# EAGLE design first proper board (EAGLE 9.6.2)
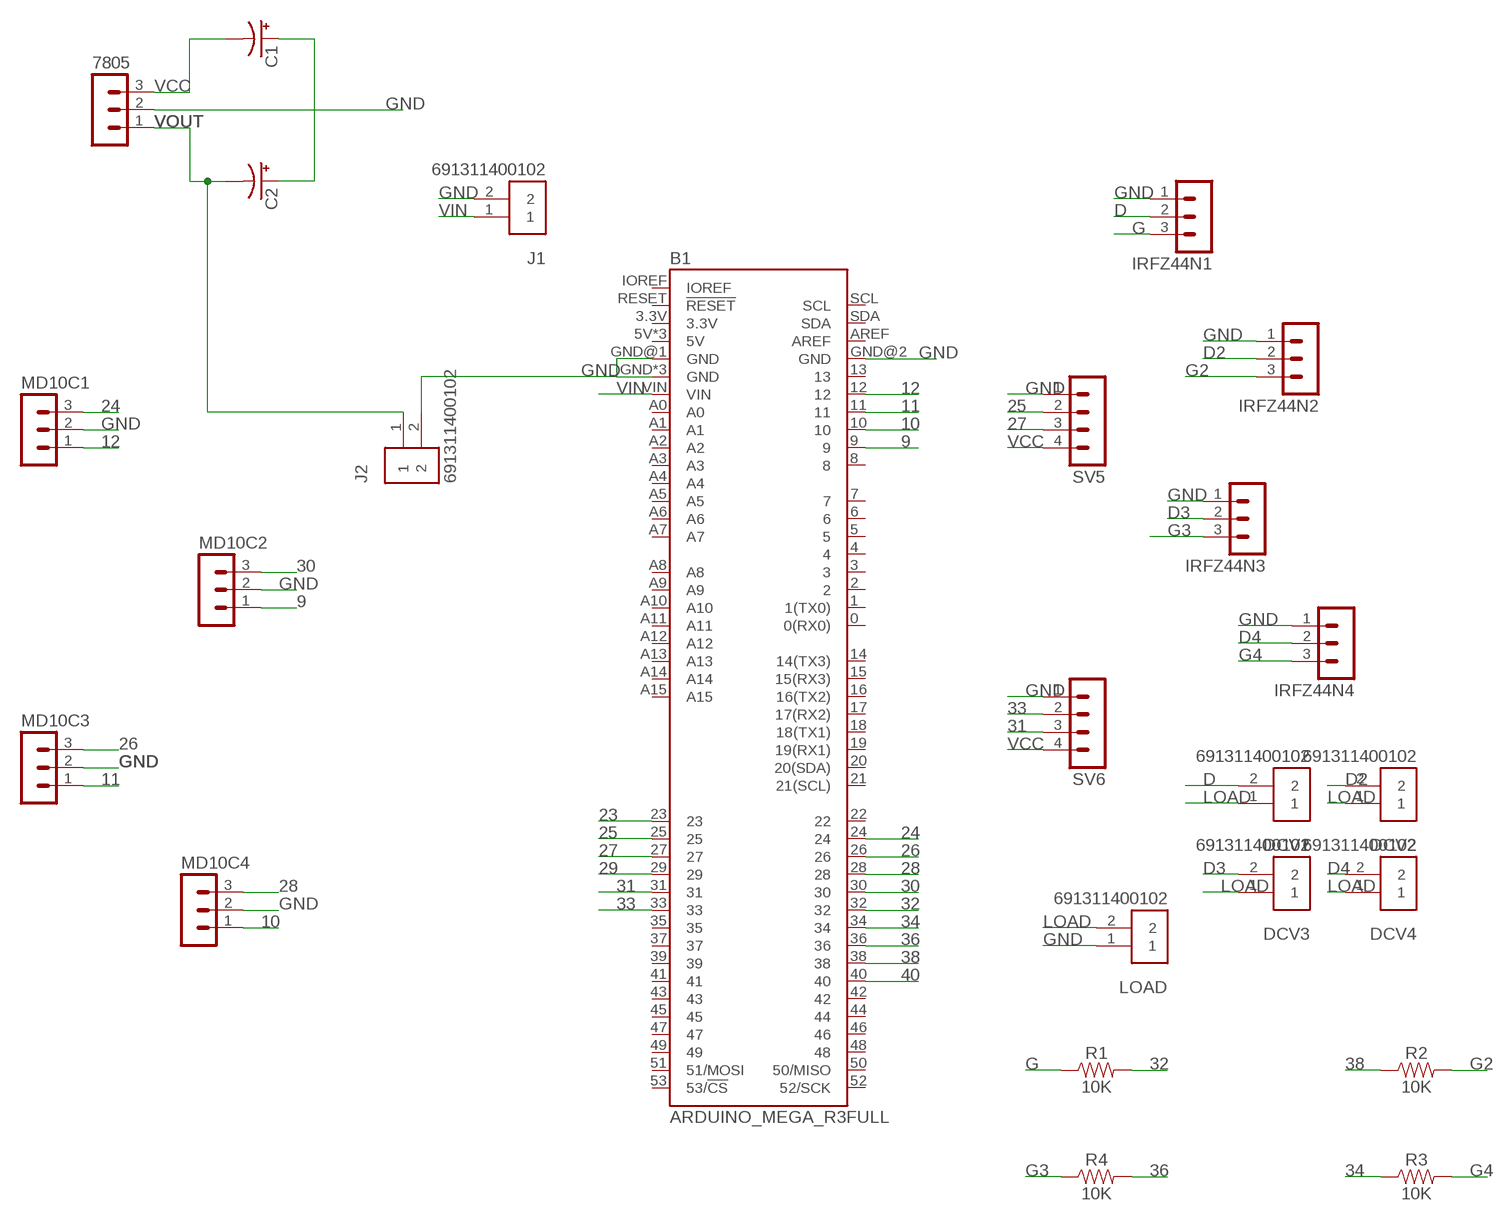
[diagram p0: schematic, sheet 1]

## Parts
7805  MA03-1  [MA03-1]
B1  ARDUINO_MEGA_R3FULL  [ARDUINO_MEGA_NO_SILK]
C1  1F-2.7V(PTH)CPOL-RADIAL-1H-2.7V  [CPOL-RADIAL-1F-2.7V]
C2  1F-2.7V(PTH)CPOL-RADIAL-1H-2.7V  [CPOL-RADIAL-1F-2.7V]
DCV1  691311400102  [TERMINALBLOCK_PLUGGABLE-2-7.62MM]
DCV2  691311400102  [TERMINALBLOCK_PLUGGABLE-2-7.62MM]
DCV3  691311400102  [TERMINALBLOCK_PLUGGABLE-2-7.62MM]
DCV4  691311400102  [TERMINALBLOCK_PLUGGABLE-2-7.62MM]
IRFZ44N1  MA03-1  [MA03-1]
IRFZ44N2  MA03-1  [MA03-1]
IRFZ44N3  MA03-1  [MA03-1]
IRFZ44N4  MA03-1  [MA03-1]
J1  691311400102  [TERMINALBLOCK_PLUGGABLE-2-7.62MM]
J2  691311400102  [TERMINALBLOCK_PLUGGABLE-2-7.62MM]
LOAD  691311400102  [TERMINALBLOCK_PLUGGABLE-2-7.62MM]
MD10C1  MA03-1  [MA03-1]
MD10C2  MA03-1  [MA03-1]
MD10C3  MA03-1  [MA03-1]
MD10C4  MA03-1  [MA03-1]
R1  10K  10KOHM-0402-1/10W-0.1%  [0402-TIGHT]
R2  10K  10KOHM-0402-1/10W-0.1%  [0402-TIGHT]
R3  10K  10KOHM-0402-1/10W-0.1%  [0402-TIGHT]
R4  10K  10KOHM-0402-1/10W-0.1%  [0402-TIGHT]
SV5  MA04-1  [MA04-1]
SV6  MA04-1  [MA04-1]

## Nets
9: B1.9 MD10C2.1
10: B1.10 MD10C4.1
11: B1.11 MD10C3.1
12: B1.12 MD10C1.1
23: B1.23
24: B1.24 MD10C1.3
25: B1.25 SV5.2
26: B1.26 MD10C3.3
27: B1.27 SV5.3
28: B1.28 MD10C4.3
29: B1.29
30: B1.30 MD10C2.3
31: B1.31 SV6.3
32: B1.32 R1.2
33: B1.33 SV6.2
34: B1.34 R3.1
36: B1.36 R4.2
38: B1.38 R2.1
40: B1.40
D: DCV1.2 IRFZ44N1.2
D2: DCV2.2 IRFZ44N2.2
D3: DCV3.2 IRFZ44N3.2
D4: DCV4.2 IRFZ44N4.2
G: IRFZ44N1.3 R1.1
G2: IRFZ44N2.3 R2.2
G3: IRFZ44N3.3 R4.1
G4: IRFZ44N4.3 R3.2
GND: 7805.2 B1.GND B1.GND@1(GND) B1.GND@2(GND) B1.GND@3(GND) B1.GND@4(GND) IRFZ44N1.1 IRFZ44N2.1 IRFZ44N3.1 IRFZ44N4.1 J1.2 J2.2 LOAD.1 MD10C1.2 MD10C2.2 MD10C3.2 MD10C4.2 SV5.1 SV6.1
LOAD: DCV1.1 DCV2.1 DCV3.1 DCV4.1 LOAD.2
N$1: C1.+ C2.+
VCC: 7805.3 C1.- SV5.4 SV6.4
VIN: B1.VIN J1.1
VOUT: 7805.1 C2.- J2.1
Unconnected: B1.0(0(RX0)) B1.1(1(TX0)) B1.2 B1.3 B1.3.3V B1.4 B1.5 B1.5V B1.5V@1(5V) B1.5V@2(5V) B1.6 B1.7 B1.8 B1.13 B1.14(14(TX3)) B1.15(15(RX3)) B1.16(16(TX2)) B1.17(17(RX2)) B1.18(18(TX1)) B1.19(19(RX1)) B1.20(20(SDA)) B1.21(21(SCL)) B1.22 B1.35 B1.37 B1.39 B1.41 B1.42 B1.43 B1.44 B1.45 B1.46 B1.47 B1.48 B1.49 B1.50(50/MISO) B1.51(51/MOSI) B1.52(52/SCK) B1.53(53/!CS) B1.A0 B1.A1 B1.A2 B1.A3 B1.A4 B1.A5 B1.A6 B1.A7 B1.A8 B1.A9 B1.A10 B1.A11 B1.A12 B1.A13 B1.A14 B1.A15 B1.AREF B1.IOREF B1.RESET(!RESET) B1.SCL B1.SDA

## Library data of the parts
7805 IRFZ44N1-IRFZ44N4 MD10C1-MD10C4 = con-lstb:MA03-1: PIN HEADER; OC_FARNELL: unknown; OC_NEWARK: unknown
B1 = SparkFun-Boards:ARDUINO_MEGA_R3: Arduino Mega R3 ATmega2560 R3 compatible footprint. SparkFun Products: Arduino Mega 2560 R3 <https://www.sparkfun.com/products/11061>
C1 C2 = SparkFun-Capacitors:1F-2.7V(PTH): 1F 2.7V SuperCapacitor CAP-14696; PROD_ID: CAP-14696
DCV1-DCV4 J1 J2 LOAD = Terminal Blocks FOR USE IN PB:691311400102: 7.62MM CLOSE VERTICAL PCB HEADER WR-TBL Manufacturer's datasheet <https://katalog.we-online.com/em/datasheet/6913114001xx.pdf>; CREATED_BY: PCBLayout.com; DIGIKEY_PART_NO: 732-2823-ND; MANUFACTURER: WURTH ELEKTRONIK; MPN: 691311400102
R1-R4 = SparkFun-Resistors:10KOHM: 10kΩ resistor A resistor is a passive two-terminal electrical component that implements electrical resistance as a circuit element. Resistors act to reduce current flow, and, at the same time, act to lower voltage levels within circuits. - Wikipedia; PROD_ID: RES-16147
SV5 SV6 = con-lstb:MA04-1: PIN HEADER; OC_FARNELL: unknown; OC_NEWARK: unknown

## Board
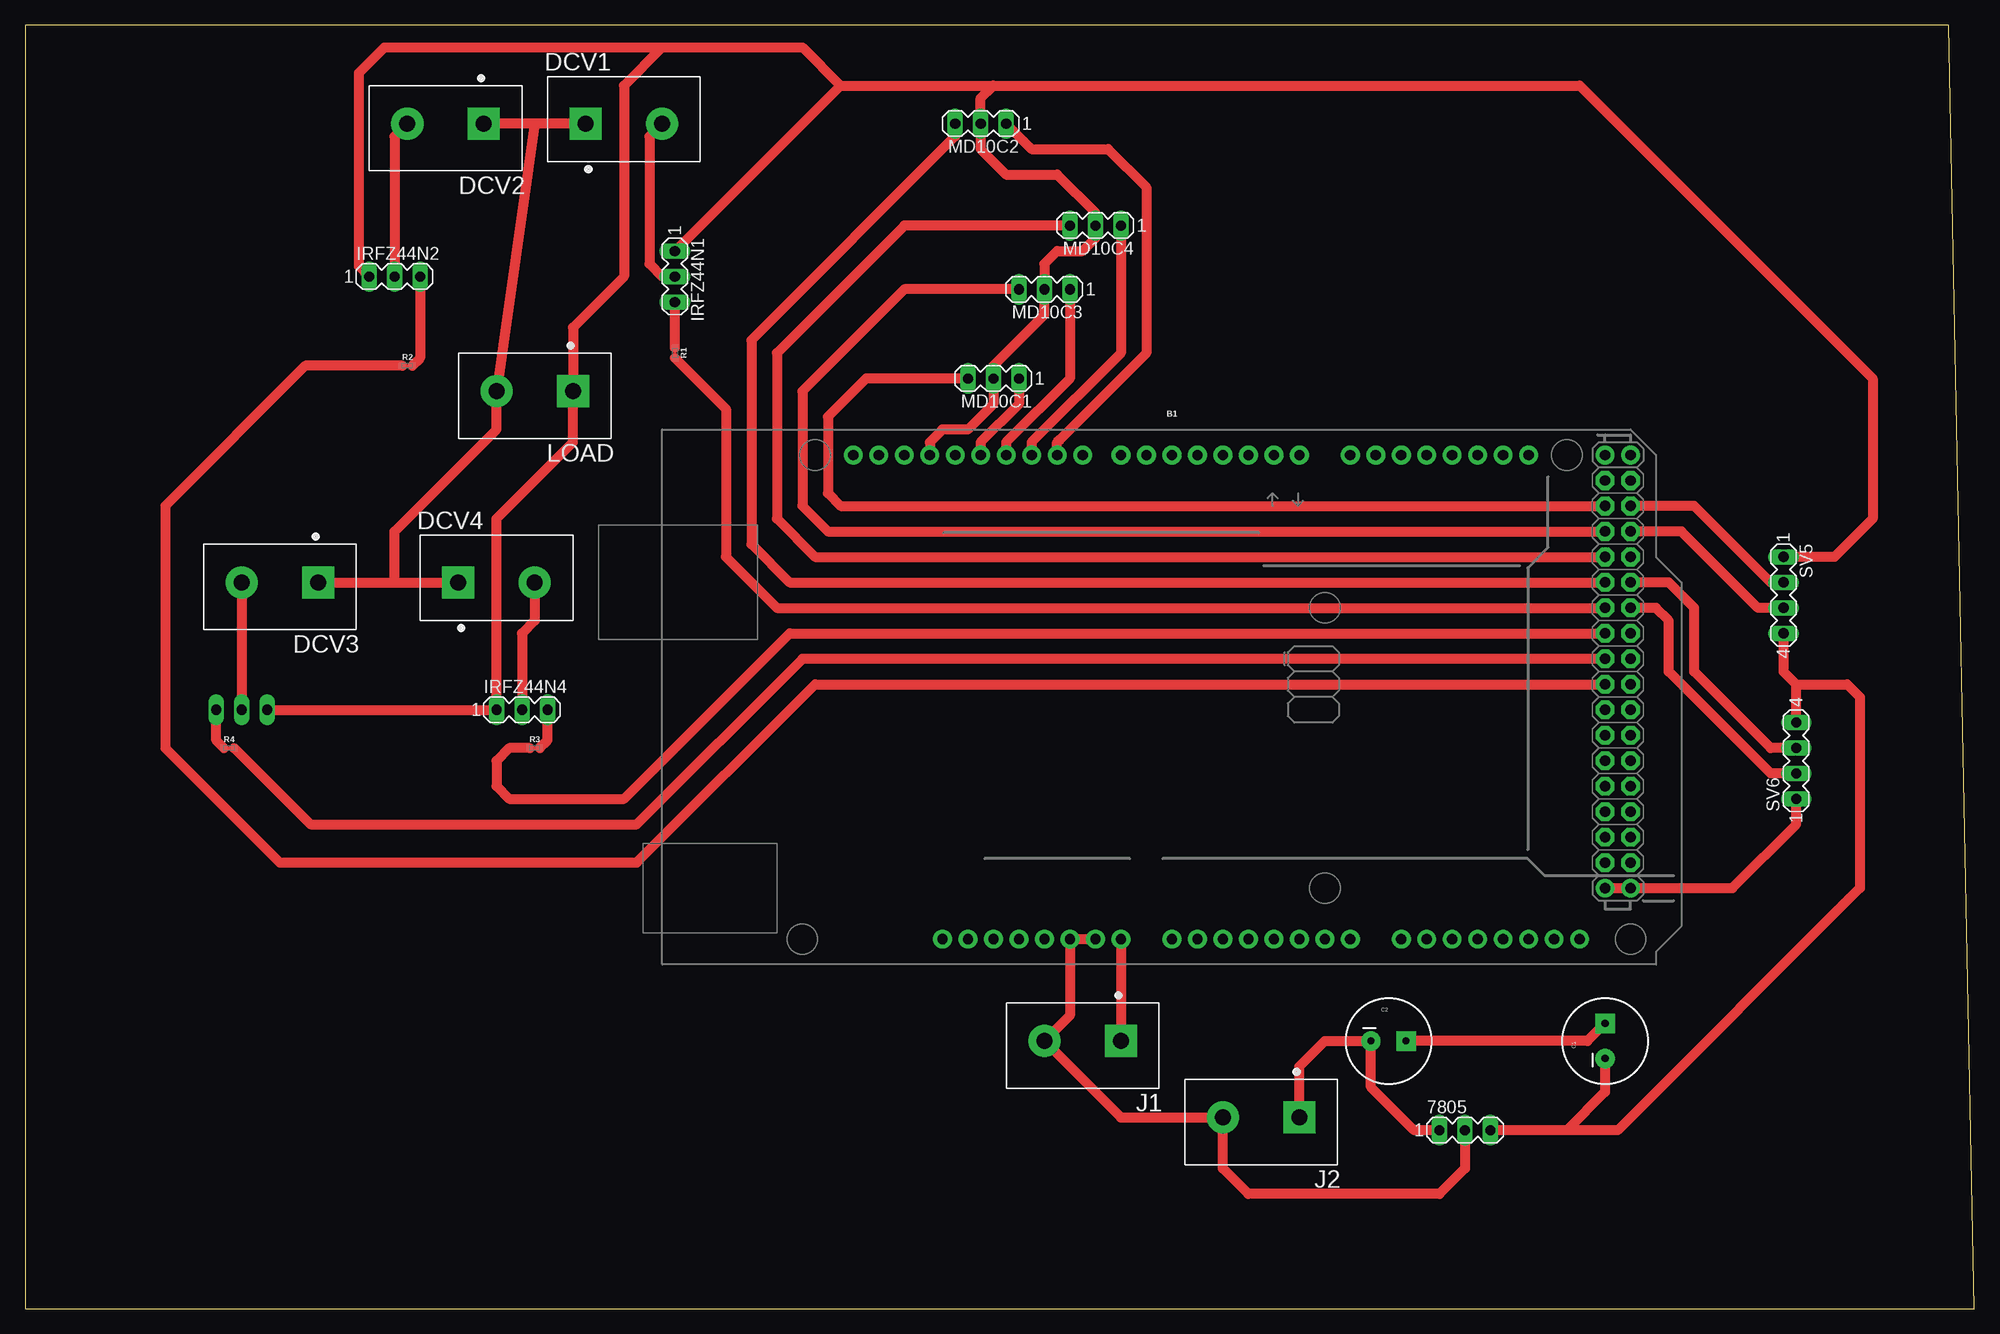
[diagram p1: board, top side]
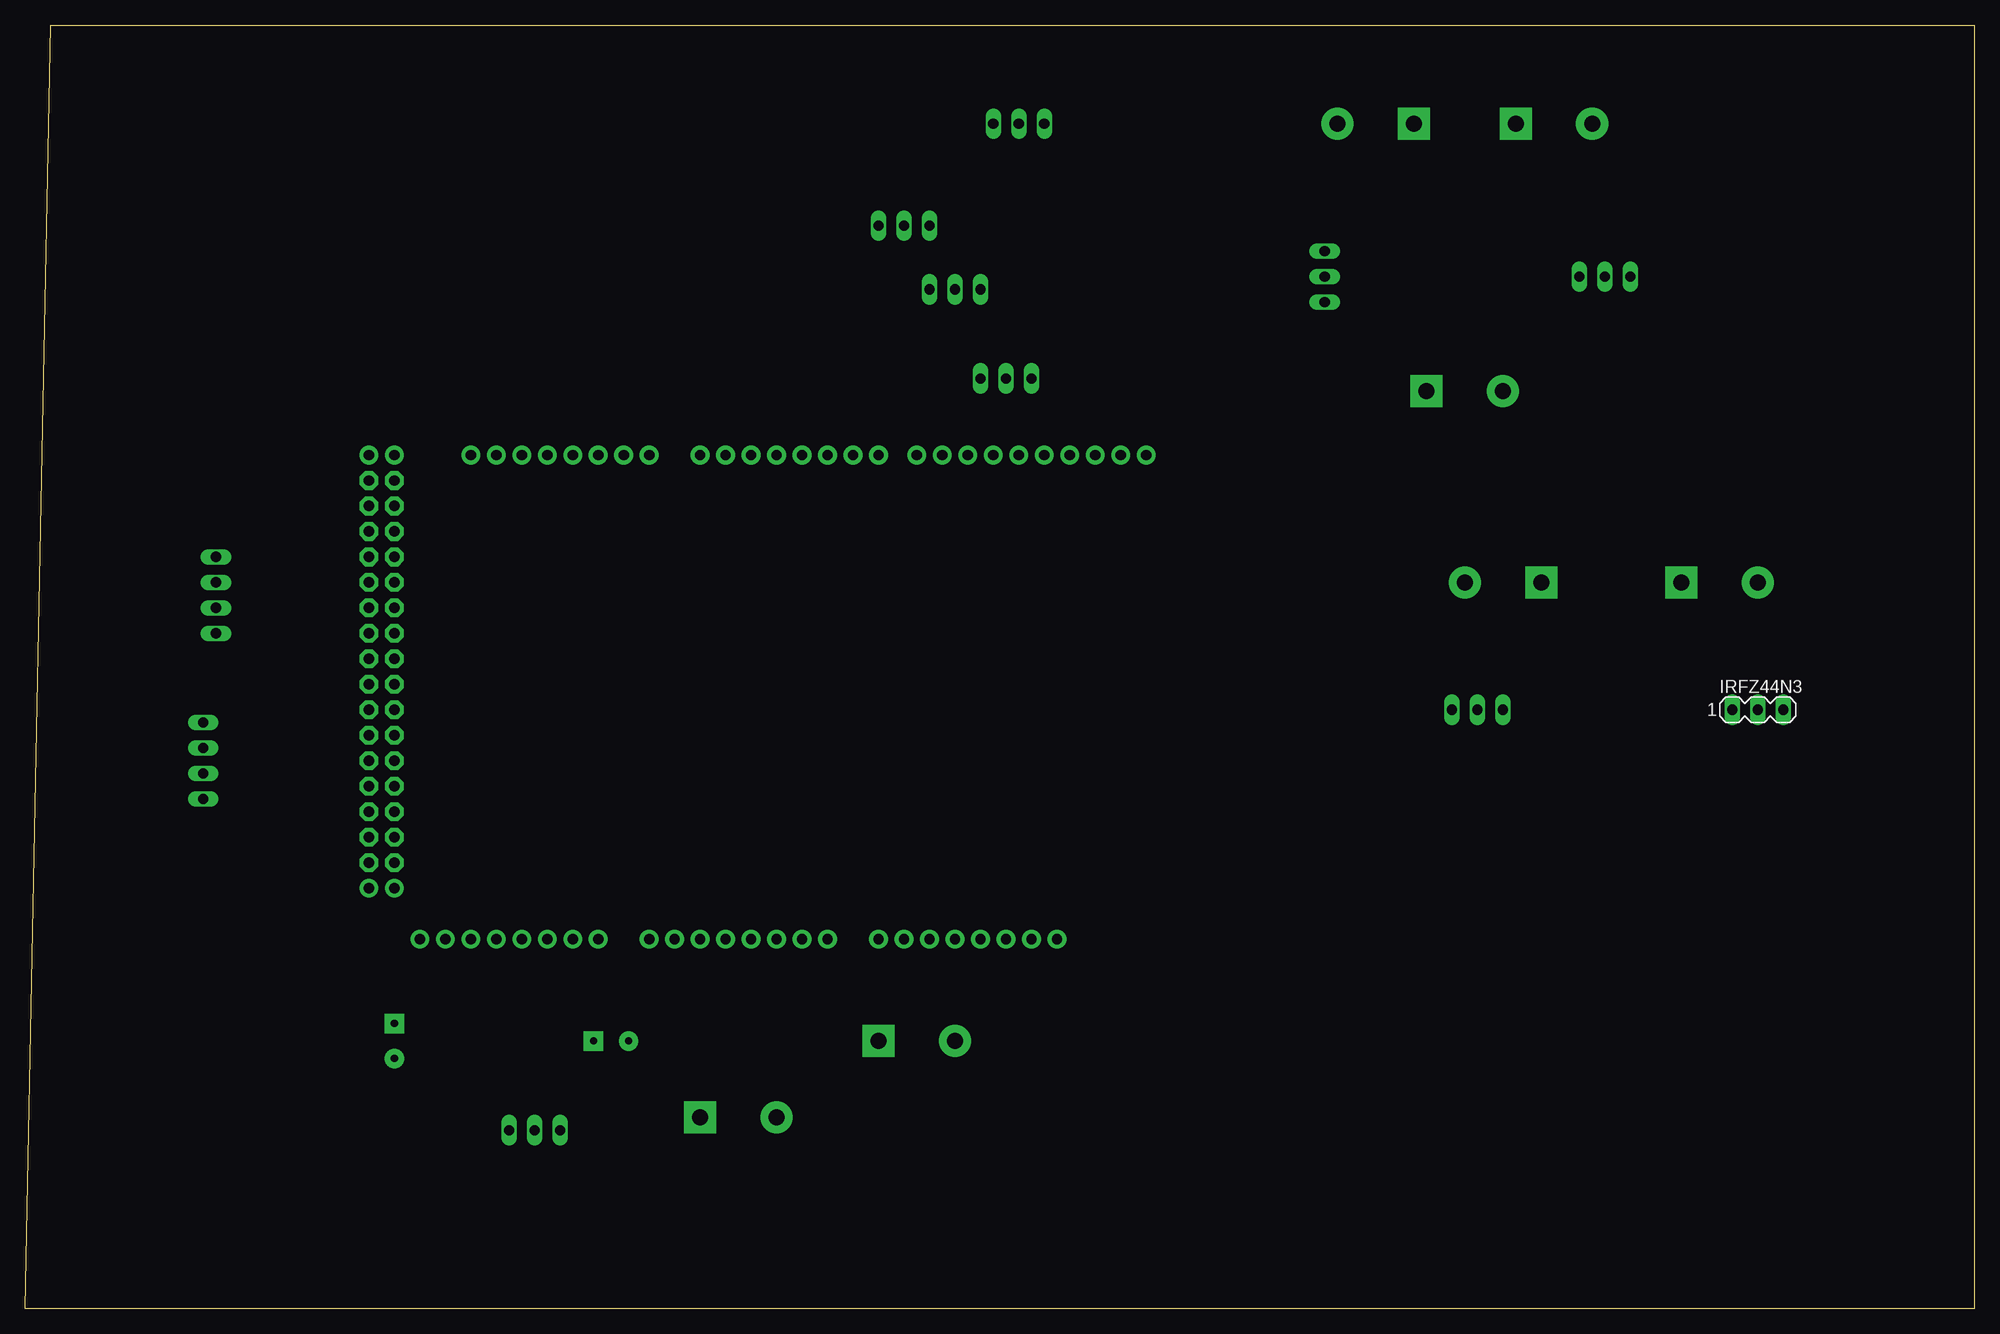
[diagram p2: board, bottom side, seen from below]

Size 194.29 x 127.94 mm. Coordinates in mm from the lower left corner, seen from the top.
Outline: 0,0 194.29,0 191.75,127.94 0,127.94 0,0
Copper layers (1*16): Top 0.035mm / dielectric 1.5mm / Bottom 0.035mm
Design rules "default": minimum track width 6mil, minimum drill 0.35mm, track to track 6mil, track to pad 6mil, pad to pad 6mil, via to via 6mil, smd to smd 6mil, copper to edge 40mil, drill to drill 6mil, minimum pad ring 10mil, minimum via ring 8mil, stop-mask expansion 4mil, vias tented up to drill 0mil, thermal gap 10mil

### Footprints (pad centres in the part's own frame; a part is rotated, then mirrored left to right if it is on the bottom)
MA03-1 = drill 1.016 long: 1 -2.54,0; 2 0,0; 3 2.54,0
ARDUINO_MEGA_NO_SILK = drill 1.016 pad 1.88: 0 13.97,24.13; 1 11.43,24.13; 2 8.89,24.13; 3 6.35,24.13; 3.3V -13.97,-24.13; 4 3.81,24.13; 5 1.27,24.13; 5V -11.43,-24.13; 5V@1 44.45,24.13; 5V@2 46.99,24.13; 6 -1.27,24.13; 7 -3.81,24.13; 8 -7.62,24.13; 9 -10.16,24.13; 10 -12.7,24.13; 11 -15.24,24.13; 12 -17.78,24.13; 13 -20.32,24.13; 14 19.05,24.13; 15 21.59,24.13; 16 24.13,24.13; 17 26.67,24.13; 18 29.21,24.13; 19 31.75,24.13; 20 34.29,24.13; 21 36.83,24.13; A0 1.27,-24.13; A1 3.81,-24.13; A2 6.35,-24.13; A3 8.89,-24.13; A4 11.43,-24.13; A5 13.97,-24.13; A6 16.51,-24.13; A7 19.05,-24.13; A8 24.13,-24.13; A9 26.67,-24.13; A10 29.21,-24.13; A11 31.75,-24.13; A12 34.29,-24.13; A13 36.83,-24.13; A14 39.37,-24.13; A15 41.91,-24.13; AREF -25.4,24.13; GND -8.89,-24.13; GND@1 -6.35,-24.13; GND@2 44.45,-19.05; GND@3 46.99,-19.05; GND@4 -22.86,24.13; IOREF -19.05,-24.13; NC -21.59,-24.13; RESET -16.51,-24.13; SCL -30.48,24.13; SDA -27.94,24.13; VIN -3.81,-24.13 | drill 1.016 pad 1.88 octagon: 22 44.45,21.59; 23 46.99,21.59; 24 44.45,19.05; 25 46.99,19.05; 26 44.45,16.51; 27 46.99,16.51; 28 44.45,13.97; 29 46.99,13.97; 30 44.45,11.43; 31 46.99,11.43; 32 44.45,8.89; 33 46.99,8.89; 34 44.45,6.35; 35 46.99,6.35; 36 44.45,3.81; 37 46.99,3.81; 38 44.45,1.27; 39 46.99,1.27; 40 44.45,-1.27; 41 46.99,-1.27; 42 44.45,-3.81; 43 46.99,-3.81; 44 44.45,-6.35; 45 46.99,-6.35; 46 44.45,-8.89; 47 46.99,-8.89; 48 44.45,-11.43; 49 46.99,-11.43; 50 44.45,-13.97; 51 46.99,-13.97; 52 44.45,-16.51; 53 46.99,-16.51
CPOL-RADIAL-1F-2.7V = drill 0.7 pad 1.93 square: + 1.75,0 | drill 0.7 pad 1.93: - -1.75,0
TERMINALBLOCK_PLUGGABLE-2-7.62MM = drill 1.6 pad 3.2 square: 1 -3.81,0 | drill 1.6 pad 3.2: 2 3.81,0
0402-TIGHT = smd 0.6 x 0.6: 1 -0.5,0; 2 0.5,0
MA04-1 = drill 1.016 long: 1 -3.81,0; 2 -1.27,0; 3 1.27,0; 4 3.81,0

### Placement (x,y rotation side)
7805  143.51,17.78 0 top
B1  113.03,60.96 0 top
C1  157.48,26.67 90 top
C2  135.89,26.67 0 top
DCV1  59.69,118.11 0 top
DCV2  41.91,118.11 180 top
DCV3  25.4,72.39 180 top
DCV4  46.99,72.39 0 top
IRFZ44N1  64.77,102.87 270 top
IRFZ44N2  36.83,102.87 0 top
IRFZ44N3  21.59,59.69 0 bottom
IRFZ44N4  49.53,59.69 0 top
J1  105.41,26.67 180 top
J2  123.19,19.05 180 top
LOAD  50.8,91.44 180 top
MD10C1  96.52,92.71 180 top
MD10C2  95.25,118.11 180 top
MD10C3  101.6,101.6 180 top
MD10C4  106.68,107.95 180 top
R1  64.77,95.25 270 top
R2  38.1,93.98 0 top
R3  50.8,55.88 0 top
R4  20.32,55.88 0 top
SV5  175.26,71.12 270 top
SV6  176.53,54.61 90 top

### Tracks (layer width: path | path; a pad name or v marks a point on that pad's centre or on a via)
9
  Top 1.016: MD10C2.1 100.33,115.57 107.95,115.57 111.76,111.76 111.76,95.25 103.2,86.69 102.87,86.36 B1.9
10
  Top 1.016: B1.10 100.33,86.36 109.22,95.25 MD10C4.1
11
  Top 1.016: MD10C3.1 104.14,92.71 97.79,86.36 B1.11
12
  Top 1.016: 99.06,91.44 MD10C1.1 99.06,90.17 95.25,86.36 B1.12
24
  Top 1.016: MD10C1.3 83.82,92.71 80.01,88.9 80.01,81.28 81.28,80.01 B1.24
25
  Top 1.016: SV5.2 173.99,72.39 166.37,80.01 162.56,80.01 161.62,80.01 B1.25
26
  Top 1.016: B1.26 80.01,77.47 77.47,80.01 77.47,91.44 87.63,101.6 MD10C3.3
27
  Top 1.016: SV5.3 172.72,69.85 165.1,77.47 162.56,77.47 161.62,77.47 B1.27
28
  Top 1.016: MD10C4.3 87.63,107.95 74.93,95.25 74.93,78.74 78.74,74.93 B1.28
30
  Top 1.016: MD10C2.3 92.71,116.84 72.39,96.52 72.39,76.2 76.2,72.39 B1.30
31
  Top 1.016: SV6.3 173.99,55.88 166.37,63.5 166.37,69.85 163.83,72.39 B1.31
32
  Top 1.016: R1.2 69.85,89.67 69.85,74.93 74.93,69.85 B1.32
33
  Top 1.016: SV6.2 173.99,53.34 163.83,63.5 163.83,68.58 162.56,69.85 161.62,69.85 B1.33
34
  Top 1.016: R3.1 48.26,55.88 46.99,54.61 46.99,52.07 48.26,50.8 59.69,50.8 76.2,67.31 B1.34
36
  Top 1.016: R4.2 28.44,48.26 60.96,48.26 77.47,64.77 B1.36
38
  Top 1.016: R2.1 27.94,93.98 13.97,80.01 13.97,55.88 25.4,44.45 60.96,44.45 78.74,62.23 B1.38
D
  Top 1.016: DCV1.2 62.23,116.84 62.23,104.14 63.5,102.87 IRFZ44N1.2
D2
  Top 1.016: DCV2.2 36.83,116.84 IRFZ44N2.2
D3
  Top 1.016: DCV3.2 IRFZ44N3.2
D4
  Top 1.016: DCV4.2 50.8,68.58 49.53,67.31 IRFZ44N4.2
G
  Top 1.016: R1.1 IRFZ44N1.3
G2
  Top 1.016: IRFZ44N2.3 39.37,94.75 R2.2
G3
  Top 1.016: IRFZ44N3.3 19.05,56.65 R4.1
G4
  Top 1.016: IRFZ44N4.3 52.07,56.65 R3.2
GND
  Top 1.016: B1.GND@4 90.17,86.36 91.44,87.63 93.98,87.63 96.52,90.17 MD10C1.2 96.52,93.98 101.6,99.06 MD10C3.2 101.6,104.14 102.87,105.41 105.41,105.41 106.68,106.68 MD10C4.2 106.68,109.22 102.87,113.03 97.79,113.03 95.25,115.57 MD10C2.2 95.25,120.65 96.52,121.92 | B1.GND@2 B1.GND@3 170.18,41.91 176.53,48.26 SV6.1 | B1.GND@1 B1.GND 104.14,29.21 J1.2 109.22,19.05 J2.2 119.38,13.97 121.92,11.43 140.97,11.43 143.51,13.97 7805.2 | 96.52,121.92 154.94,121.92 184.15,92.71 184.15,78.74 180.34,74.93 SV5.1 | IRFZ44N1.1 81.28,121.92 | 81.28,121.92 96.52,121.92 | IRFZ44N2.1 33.27,103.89 33.27,123.19 35.81,125.73 63.5,125.73 | 81.28,121.92 77.47,125.73 63.5,125.73 | IRFZ44N3.1 IRFZ44N4.1 46.99,78.74 54.61,86.36 LOAD.1 54.61,97.79 59.69,102.87 59.69,121.92 63.5,125.73
LOAD
  Top 1.016: DCV1.1 50.8,118.11 | 50.8,118.11 DCV2.1 | 50.8,118.11 LOAD.2 46.99,87.63 36.83,77.47 36.83,72.39 | DCV3.1 36.83,72.39 | 36.83,72.39 DCV4.1
N$1
  Top 1.016: C1.+ 155.73,26.67 C2.+
VCC
  Top 1.016: 176.53,62.23 175.26,63.5 SV5.4 | SV6.4 176.53,62.23 | 176.53,62.23 181.61,62.23 182.88,60.96 182.88,41.91 158.75,17.78 153.67,17.78 | 7805.3 148.59,17.78 153.67,17.78 | C1.- 157.48,21.59 153.67,17.78
VIN
  Top 1.016: B1.VIN J1.1
VOUT
  Top 1.016: 7805.1 138.43,17.78 134.14,22.07 C2.- 129.54,26.67 127,24.13 J2.1